# EAGLE design regulator (EAGLE 5.09)
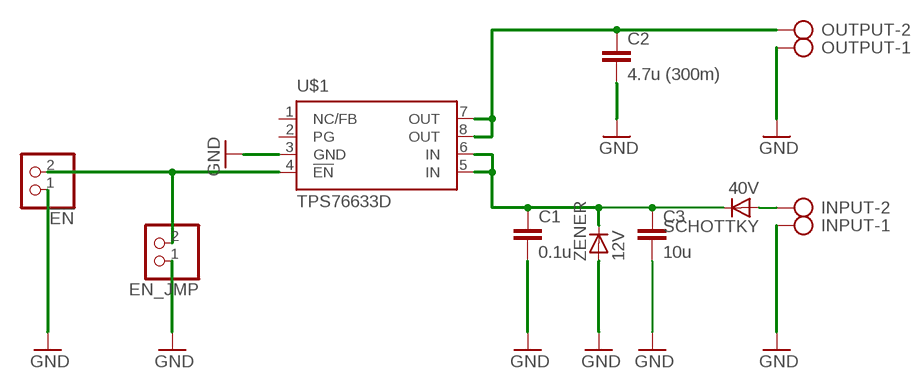
[diagram p0: schematic, sheet 1]

## Parts
!EN  PINHD-1X2  [1X02]
C1  0.1u  C-EUC1206  [C1206]
C2  4.7u (300m)  C-EUC1206  [C1206]
C3  10u  C-EUC1206  [C1206]
EN_JMP  PINHD-1X2  [1X02]
INPUT  AK300/2  [AK300/2]
OUTPUT  AK300/2  [AK300/2]
SCHOTTKY  40V  D-SMB  [SMB]
U$1  TPS76633D  [DGK-R-PDSO-G8]
ZENER  12V  D-SMB  [SMB]

## Nets
GND: !EN.1 C1.2 C2.2 C3.2 EN_JMP.1 INPUT.1 OUTPUT.1 U$1.3(GND) ZENER.2(A)
N$1: !EN.2 EN_JMP.2 U$1.4(!EN)
N$3: C1.1 C3.1 SCHOTTKY.1(C) U$1.5(IN) U$1.6(IN) ZENER.1(C)
N$4: C2.1 OUTPUT.2 U$1.7(OUT) U$1.8(OUT)
N$5: INPUT.2 SCHOTTKY.2(A)
Unconnected: U$1.1(NC/FB) U$1.2(PG)

## Library data of the parts
!EN EN_JMP = pinhead:PINHD-1X2: PIN HEADER
C1-C3 = resistor:C-EU: CAPACITOR, European symbol
INPUT OUTPUT = con-ptr500:AK300/2: CONNECTOR
SCHOTTKY ZENER = semicon-smd-ipc:D-: DIODE unfilled
U$1 = regu:TPS76633D

## Board
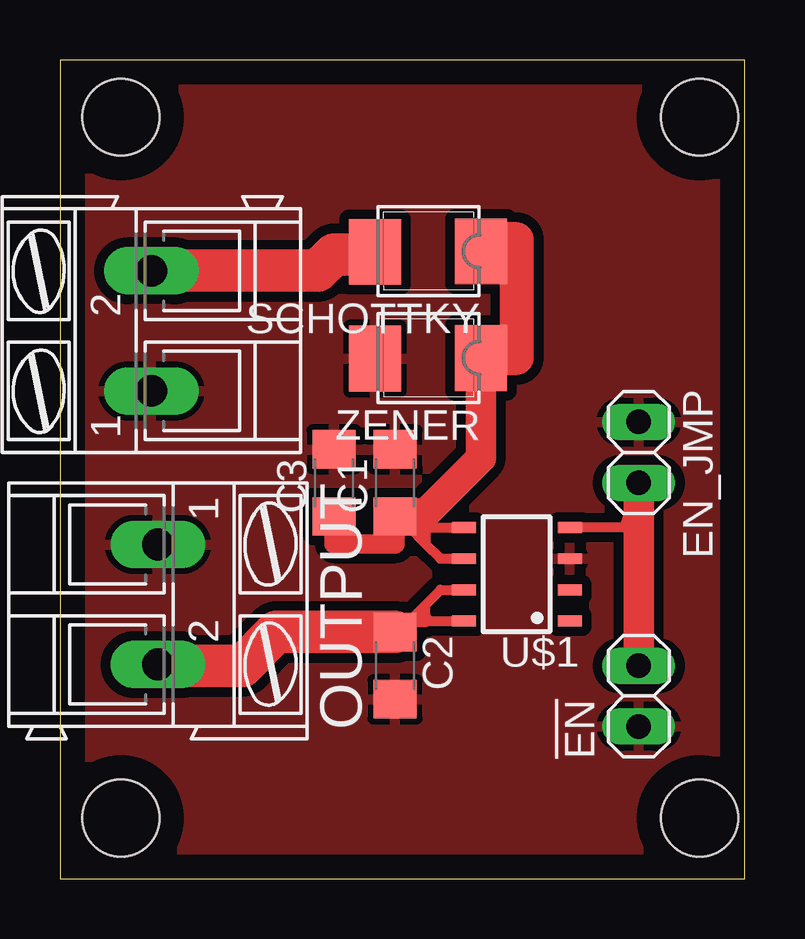
[diagram p1: board, top side]
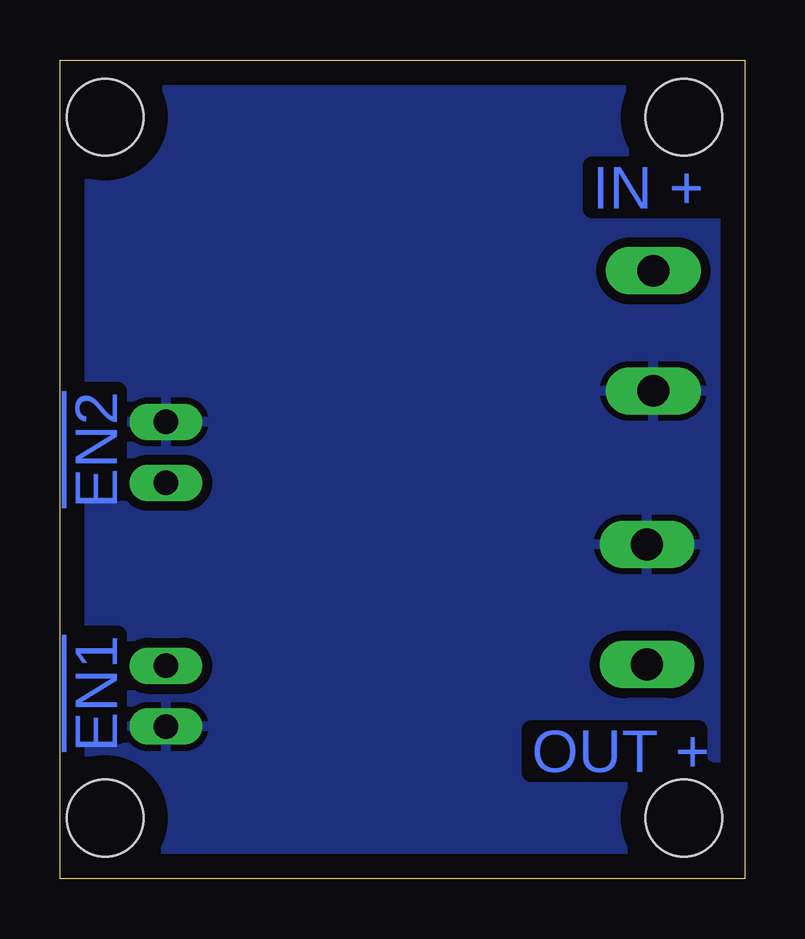
[diagram p2: board, bottom side, seen from below]

Size 28.55 x 34.14 mm. Coordinates in mm from the lower left corner, seen from the top.
Outline: 0,0 28.55,0 28.55,34.14 0,34.14 0,0
Copper layers (1*16): Top 0.035mm / dielectric 1.5mm / Bottom 0.035mm
Design rules "default *": minimum track width 10mil, minimum drill 0.6mm, track to track 16mil, track to pad 16mil, pad to pad 16mil, via to via 16mil, smd to smd 16mil, copper to edge 40mil, drill to drill 8mil, minimum pad ring 10mil, minimum via ring 8mil, stop-mask expansion 4mil, vias tented up to drill 0mil, thermal gap 10mil
Holes 3.2 mm at 2.54,31.75 26.67,31.75 26.67,2.54 2.54,2.54

### Footprints (pad centres in the part's own frame; a part is rotated, then mirrored left to right if it is on the bottom)
1X02 = drill 1.016 long: 1 -1.27,0; 2 1.27,0
C1206 = smd 1.6 x 1.8: 1 -1.4,0; 2 1.4,0
AK300/2 = drill 1.321 long: 1 -2.515,0; 2 2.489,0
SMB = smd 2.159 x 2.743: 1 -2.311,-0.127; 2 2.108,-0.102
DGK-R-PDSO-G8 = smd 0.45 x 1: 1 -1.95,-2.21; 2 -0.65,-2.21; 3 0.65,-2.21; 4 1.95,-2.21; 5 1.95,2.21; 6 0.65,2.21; 7 -0.65,2.21; 8 -1.95,2.21

### Placement (x,y rotation side)
!EN  24.13,7.62 90 top
C1  13.97,16.51 90 top
C2  13.97,8.89 270 top
C3  11.43,16.51 90 top
EN_JMP  24.13,17.78 270 top
INPUT  3.81,22.86 90 top
OUTPUT  4.08,11.43 270 top
SCHOTTKY  15.24,26.04 180 top
U$1  19.05,12.7 90 top
ZENER  15.24,21.59 180 top

### Tracks (layer width: path | path; a pad name or v marks a point on that pad's centre or on a via)
GND
  pour Top: 0,34.15 0,0 28.88,0 28.88,34.15
  pour Bottom: 0,34.29 28.57,34.29 28.57,0 0,0
N$1
  Top 0.406: U$1.4 23.54,14.65 EN_JMP.2
  Top 1.27: !EN.2 EN_JMP.2
N$3
  Top 0.406: U$1.5 15.29,14.65 15.24,14.61 | 15.24,15.24 15.24,14.61 | U$1.6 15.86,13.35 15.24,13.97 | 15.24,14.61 15.24,13.97 | 15.24,13.97 14.61,14.61
  Top 0.61: 15.24,14.61 14.61,14.61
  Top 0.813: C1.1 13.97,13.97 11.43,13.97 C3.1
  Top 1.27: ZENER.1 17.55,17.55 15.24,15.24 14.1,15.24 C1.1
  Top 1.422: ZENER.1 19.05,21.72 19.05,26.67 17.55,26.67 SCHOTTKY.1
N$4
  Top 0.406: 15.24,10.75 14.43,10.75 C2.1 | 15.24,10.75 U$1.8 | U$1.7 15.86,12.05 15.24,11.43 | 15.24,10.75 15.24,10.79 15.24,11.43 | 15.24,11.43 14.61,10.79
  Top 0.61: 15.24,10.79 14.61,10.79
  Top 1.778: C2.1 9.02,10.29 7.62,8.89 4.13,8.89 OUTPUT.2
N$5
  Top 1.778: INPUT.2 10.74,25.35 11.43,26.04 13.03,26.04 SCHOTTKY.2

### Text on the board
Bottom: IN + | !EN2 | !EN1 | OUT +